# EAGLE design attinyboard (EAGLE 7.5.0)
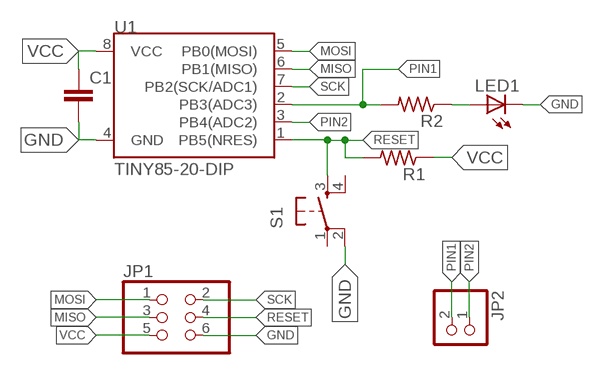
[diagram p0: schematic, sheet 1]

## Parts
C1  C-EU025-030X050  [C025-030X050]
JP1  PINHD-2X3  [2X03]
JP2  PINHD-1X2  [1X02]
LED1  LED5MM  [LED5MM]
R1  R-US_0204/7  [0204/7]
R2  R-US_0204/7  [0204/7]
S1  TAC_SWITCHPTH  [TACTILE-PTH]
U1  TINY85-20-DIP  ATTINY45TINY85-20-DIP  [DIP08]

## Nets
GND: C1.2 JP1.6 LED1.K(C) S1.2 U1.4(GND)
MISO: JP1.3 U1.6(PB1(MISO))
MOSI: JP1.1 U1.5(PB0(MOSI))
N$3: LED1.A R2.1
PIN1: JP2.2 R2.2 U1.2(PB3(ADC3))
PIN2: JP2.1 U1.3(PB4(ADC2))
RESET: JP1.4 R1.2 S1.3 U1.1(PB5(NRES))
SCK: JP1.2 U1.7(PB2(SCK/ADC1))
VCC: C1.1 JP1.5 R1.1 U1.8(VCC)
Unconnected: S1.1 S1.4

## Library data of the parts
C1 = resistor:C-EU: CAPACITOR, European symbol
JP1 = pinhead:PINHD-2X3: PIN HEADER
JP2 = pinhead:PINHD-1X2: PIN HEADER
LED1 = led:LED: LED OSRAM: - CHIPLED LG R971, LG N971, LY N971, LG Q971, LY Q971, LO R971, LY R971 LH N974, LH R974 LS Q976, LO Q976, LY Q976 LO Q996 - Hyper CHIPLED LW Q18S LB Q993, LB Q99A, LB R99A - SideLED LS A670, LO A670, LY A670, LG A670, LP A670 LB A673, LV A673, LT A673, LW A673 LH A674 LY A675 LS A676, LA A676, LO A676, LY A676, LW A676 LS A679, LY A679, LG A679 - Hyper Micro SIDELED® LS Y876, LA Y876, LO Y876, LY Y876 LT Y87S - SmartLED LW L88C, LW L88S LB L89C, LB L89S, LG L890 LS L89K, LO L89K, LY L89K LS L896, LA L896, LO L896, LY L896 - TOPLED LS T670, LO T670, LY T670, LG T670, LP T670 LSG T670, LSP T670, LSY T670, LOP T670, LYG T670 LG T671, LOG T671, LSG T671 LB T673, LV T673, LT T673, LW T673 LH T674 LS T676, LA T676, LO T676, LY T676, LB T676, LH T676, LSB T676, LW T676 LB T67C, LV T67C, LT T67C, LS T67K, LO T67K, LY T67K, LW E67C LS E67B, LA E67B, LO E67B, LY E67B, LB E67C, LV E67C, LT E67C LW T67C LS T679, LY T679, LG T679 LS T770, LO T770, LY T770, LG T770, LP T770 LB T773, LV T773, LT T773, LW T773 LH T774 LS E675, LA E675, LY E675, LS T675 LS T776, LA T776, LO T776, LY T776, LB T776 LHGB T686 LT T68C, LB T68C - Hyper Mini TOPLED® LB M676 - Mini TOPLED Santana® LG M470 LS M47K, LO M47K, LY M47K Source: http://www.osram.convergy.de LUXEON: - LUMILED® LXK2-PW12-R00, LXK2-PW12-S00, LXK2-PW14-U00, LXK2-PW14-V00 LXK2-PM12-R00, LXK2-PM12-S00, LXK2-PM14-U00 LXK2-PE12-Q00, LXK2-PE12-R00, LXK2-PE12-S00, LXK2-PE14-T00, LXK2-PE14-U00 LXK2-PB12-K00, LXK2-PB12-L00, LXK2-PB12-M00, LXK2-PB14-N00, LXK2-PB14-P00, LXK2-PB14-Q00 LXK2-PR12-L00, LXK2-PR12-M00, LXK2-PR14-Q00, LXK2-PR14-R00 LXK2-PD12-Q00, LXK2-PD12-R00, LXK2-PD12-S00 LXK2-PH12-R00, LXK2-PH12-S00 LXK2-PL12-P00, LXK2-PL12-Q00, LXK2-PL12-R00 Source: www.luxeon.com KINGBRIGHT: KA-3528ASYC Source: www.kingbright.com
R1 R2 = resistor:R-US_: RESISTOR, American symbol
S1 = SparkFun-Retired:TAC_SWITCH: Momentary Switch Button commonly used for reset or general input. Spark Fun Electronics SKU : COM-00097 SMT- SWCH-08247
U1 = SparkFun-DigitalIC:ATTINY45: Atmel 8-pin 2/4/8kB flash uC; PROD_ID: IC-09445

## Board
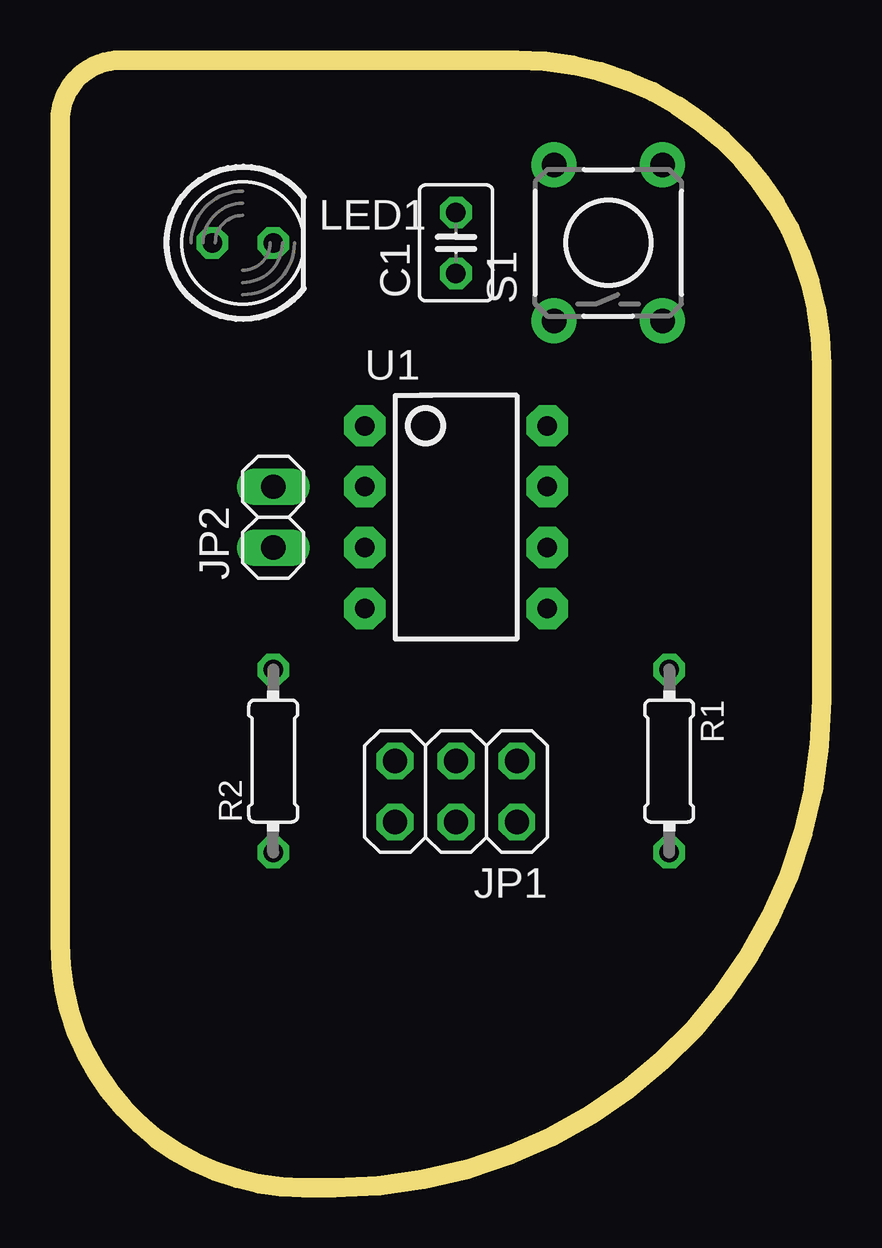
[diagram p1: board, top side]
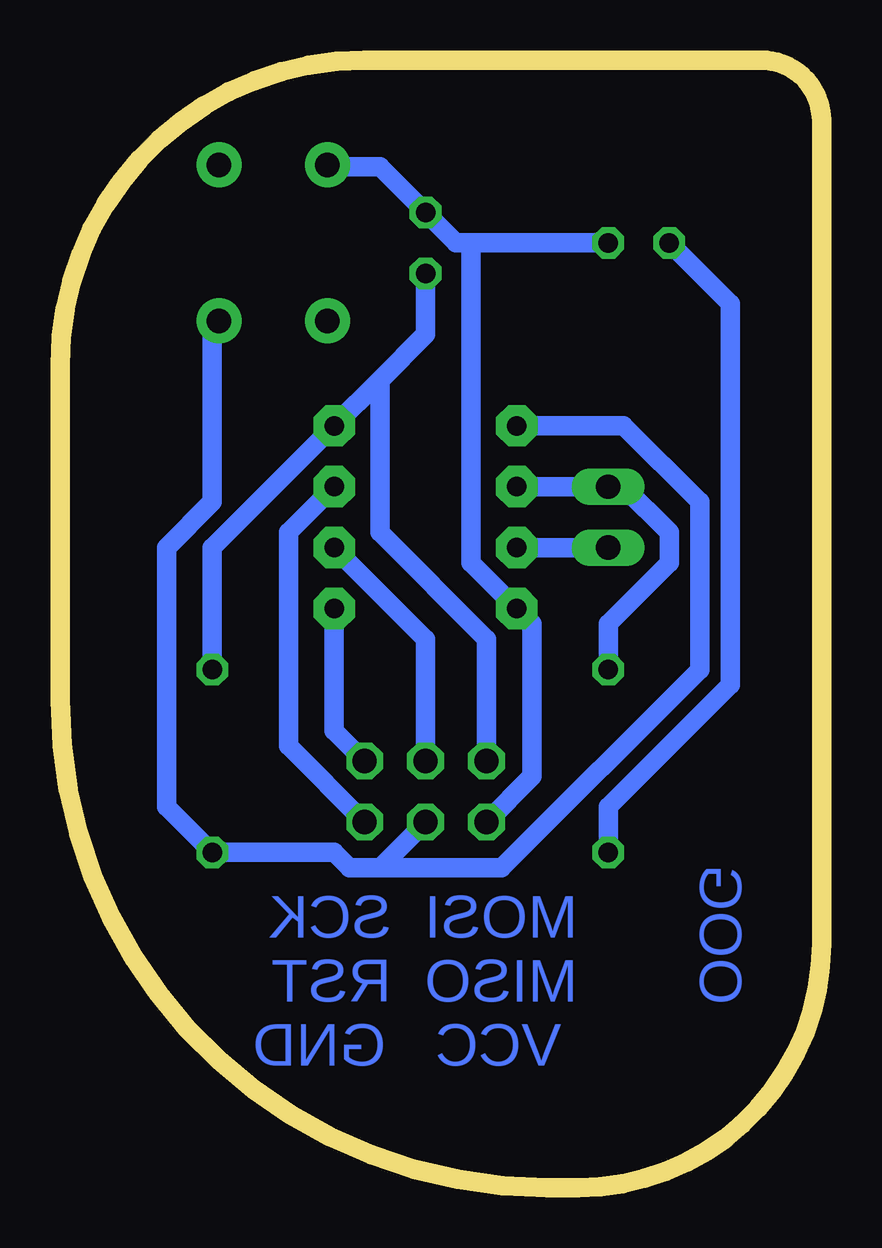
[diagram p2: board, bottom side, seen from below]

Size 31.75 x 46.99 mm. Coordinates in mm from the lower left corner, seen from the top.
Outline: 19.05,46.99 arc-90 31.75,34.29
Outline: 31.75,20.32 arc-90 11.43,0
Outline: 10.16,0 arc-90 0,10.16
Outline: 0,44.45 arc-90 2.54,46.99
Outline: 2.54,46.99 19.05,46.99
Outline: 19.05,46.99 arc-90 31.75,34.29
Outline: 31.75,34.29 31.75,20.32
Outline: 31.75,20.32 arc-90 11.43,0
Outline: 11.43,0 10.16,0
Outline: 10.16,0 arc-90 0,10.16
Outline: 0,10.16 0,44.45
Outline: 0,44.45 arc-90 2.54,46.99
Copper layers (1*16): Top 0.035mm / dielectric 1.5mm / Bottom 0.035mm
Design rules "default *": minimum track width 32mil, minimum drill 24mil, track to track 16mil, track to pad 16mil, pad to pad 16mil, via to via 16mil, smd to smd 8mil, copper to edge 16mil, drill to drill 8mil, minimum pad ring 10mil, minimum via ring 8mil, stop-mask expansion 4mil, vias tented up to drill 0mil, thermal gap 10mil

### Footprints (pad centres in the part's own frame; a part is rotated, then mirrored left to right if it is on the bottom)
C025-030X050 = drill 0.813 octagon: 1 -1.27,0; 2 1.27,0
2X03 = drill 1.016 octagon: 1 -2.54,-1.27; 2 -2.54,1.27; 3 0,-1.27; 4 0,1.27; 5 2.54,-1.27; 6 2.54,1.27
1X02 = drill 1.016 long: 1 -1.27,0; 2 1.27,0
LED5MM = drill 0.813 octagon: A -1.27,0; K 1.27,0
0204/7 = drill 0.813 octagon: 1 -3.81,0; 2 3.81,0
TACTILE-PTH = drill 1.016 pad 1.88: 1 -3.251,2.261; 2 3.251,2.261; 3 -3.251,-2.261; 4 3.251,-2.261
DIP08 = drill 0.813 pad 1.727 octagon: 1 -3.81,-3.81; 2 -1.27,-3.81; 3 1.27,-3.81; 4 3.81,-3.81; 5 3.81,3.81; 6 1.27,3.81; 7 -1.27,3.81; 8 -3.81,3.81

### Placement (x,y rotation side)
C1  16.51,39.37 90 top
JP1  16.51,16.51 180 top
JP2  8.89,27.94 90 top
LED1  7.62,39.37 0 top
R1  25.4,17.78 270 top
R2  8.89,17.78 90 top
S1  22.86,39.37 90 top
U1  16.51,27.94 270 top

### Tracks (layer width: path | path; a pad name or v marks a point on that pad's centre or on a via)
GND
  Bottom 0.813: JP1.6 12.07,17.14 12.07,23.5 U1.4 14.61,26.04 14.61,39.37 | 14.61,39.37 15.24,39.37 C1.2 18.41,42.55 20.32,42.55 S1.2 | 14.61,39.37 LED1.K
MISO
  Bottom 0.813: JP1.3 16.51,22.86 U1.6
MOSI
  Bottom 0.813: JP1.1 20.32,19.05 U1.5
N$3
  Bottom 0.813: R2.1 8.89,15.88 3.81,20.95 3.81,36.83 LED1.A
PIN1
  Bottom 0.813: R2.2 8.89,23.5 6.35,26.04 6.35,27.3 8.26,29.21 JP2.2 U1.2
PIN2
  Bottom 0.813: U1.3 JP2.1
RESET
  Bottom 0.813: 18.41,13.33 19.68,13.33 20.32,13.97 R1.2 27.3,15.88 27.3,26.67 25.4,28.57 25.4,35.56 S1.3 | JP1.4 18.41,13.33 | U1.1 8.26,31.75 5.08,28.57 5.08,21.59 13.34,13.33 18.41,13.33
SCK
  Bottom 0.813: JP1.2 22.23,18.41 22.23,27.3 U1.7
VCC
  Bottom 0.813: R1.1 25.4,26.67 U1.8 18.41,33.66 | C1.1 16.51,35.56 18.41,33.66 | JP1.5 13.97,22.86 18.41,27.3 18.41,33.66

### Text on the board
Bottom: OOG | MOSI SCK / MISO RST / VCC GND